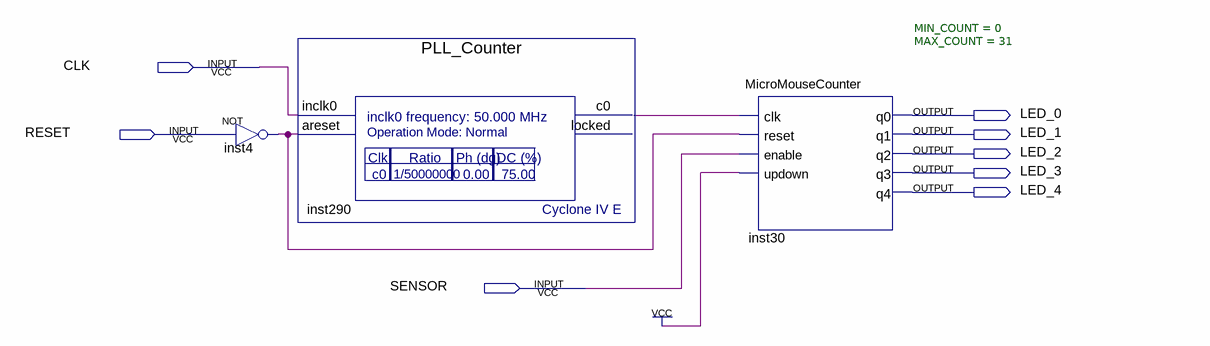
[diagram p0: schematic sheet]
// Quartus schematic MicroMouseCounter.bdf as structural Verilog: 3 symbols, 8 pins
module MicroMouseCounter (
  input  CLK,
  input  RESET,
  input  SENSOR,
  output LED_0,
  output LED_1,
  output LED_2,
  output LED_3,
  output LED_4
);

  wire inst4_out, inst290_c0;

  not inst4 (inst4_out, RESET);
  PLL_Counter inst290 (.inclk0(CLK), .areset(inst4_out), .c0(inst290_c0));  // open: locked
  MicroMouseCounter #(.MIN_COUNT(0), .MAX_COUNT(31)) inst30 (
    .clk(inst290_c0), .reset(inst4_out), .enable(SENSOR), .updown(1'b1), .q0(LED_0), .q1(LED_1), .q2(LED_2),
    .q3(LED_3), .q4(LED_4));
endmodule
